# EAGLE board base (EAGLE 9.6.1), part 1 of 2
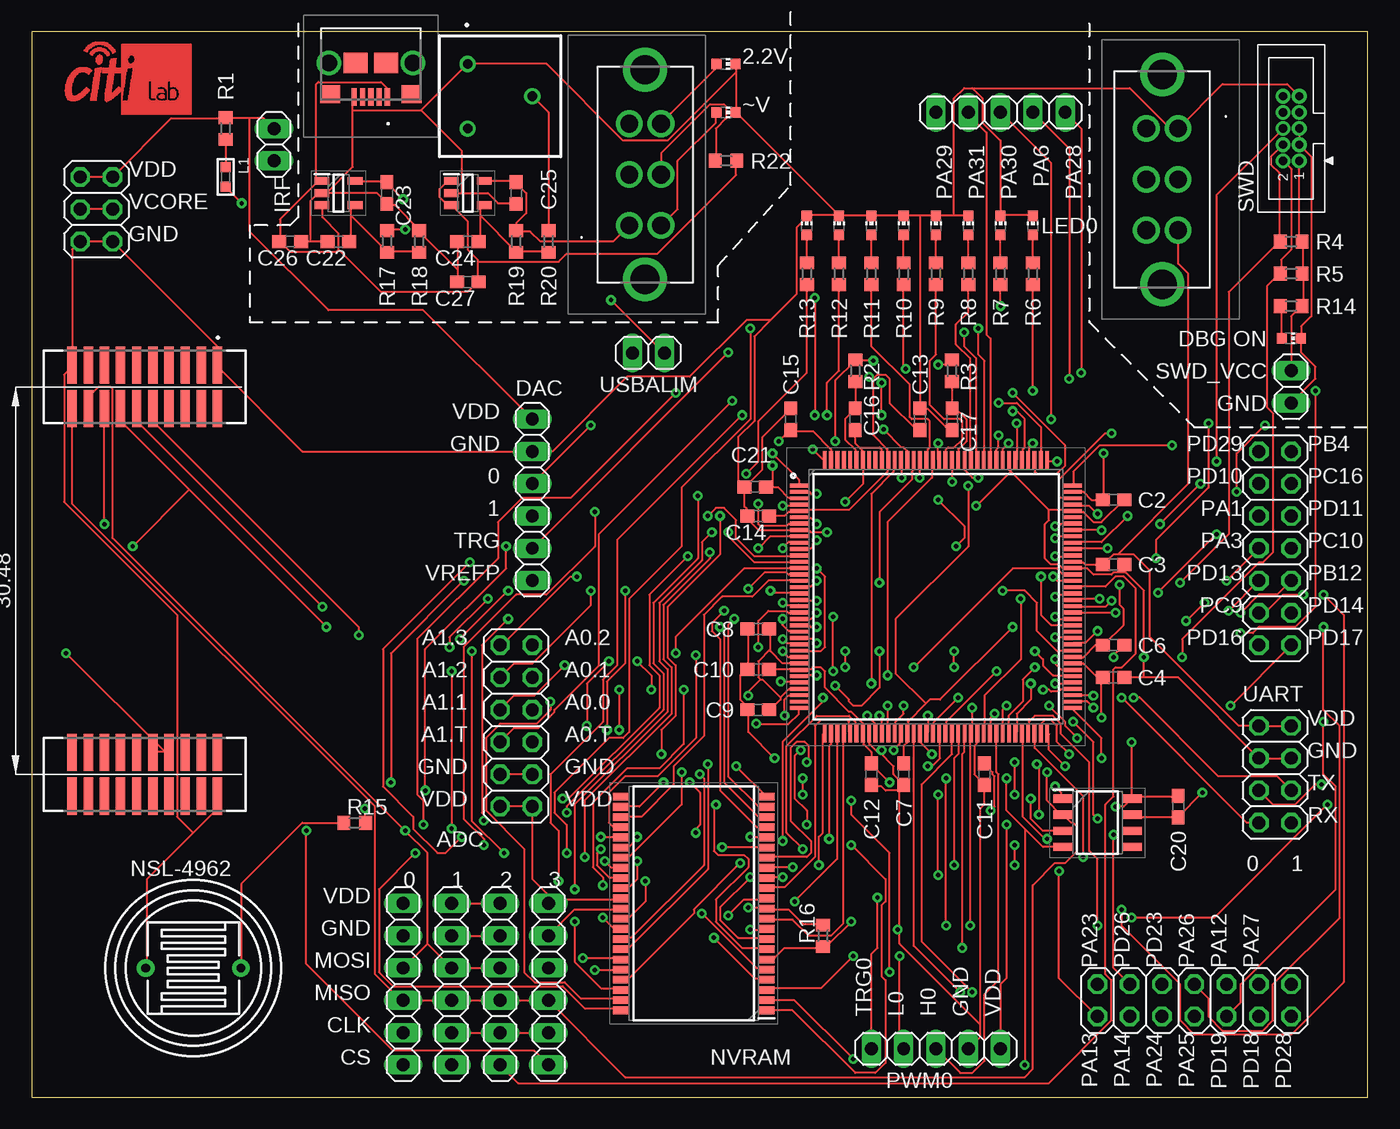
[diagram p1: board, top side]
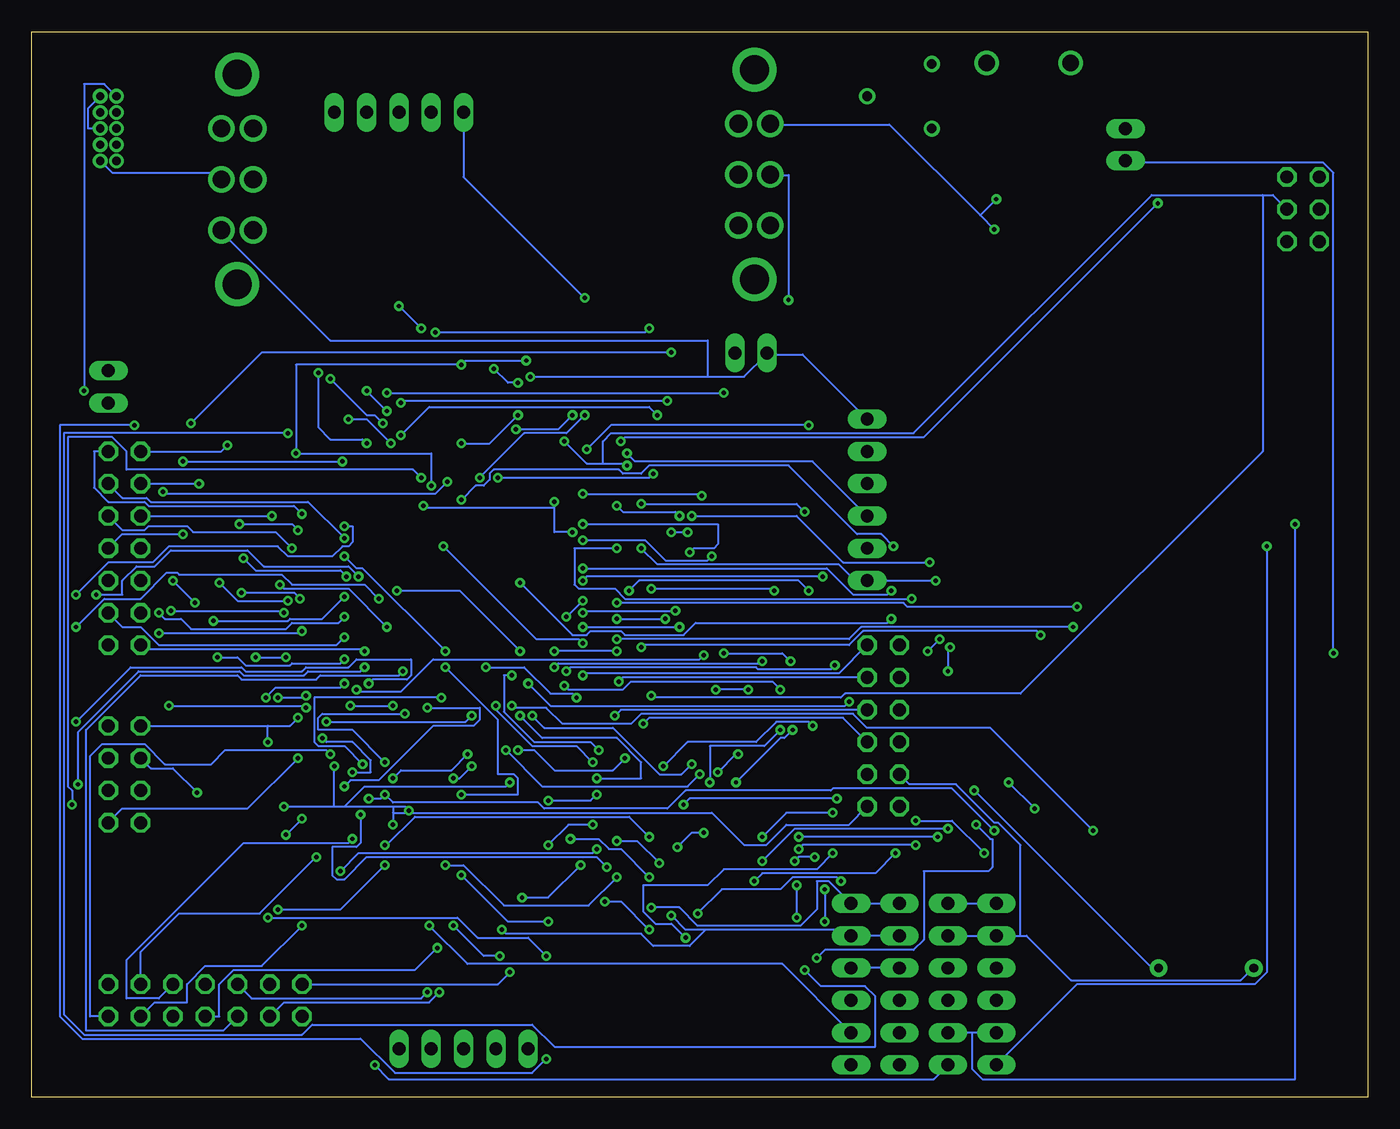
[diagram p2: board, bottom side, seen from below]

Size 105.08 x 83.81 mm. Coordinates in mm from the lower left corner, seen from the top.
Outline: 0,0 105.08,0 105.08,83.81 0,83.81 0,0
Copper layers (1*16): Top 0.035mm / dielectric 1.5mm / Bottom 0.035mm
Design rules "default": minimum track width 6mil, minimum drill 0.35mm, track to track 6mil, track to pad 6mil, pad to pad 6mil, via to via 6mil, smd to smd 6mil, copper to edge 40mil, drill to drill 6mil, minimum pad ring 10mil, minimum via ring 8mil, stop-mask expansion 4mil, vias tented up to drill 0mil, thermal gap 10mil

## Footprints (pad centres in the part's own frame; a part is rotated, then mirrored left to right if it is on the bottom)
2X06 = drill 1.016 octagon: 1 -6.35,-1.27; 2 -6.35,1.27; 3 -3.81,-1.27; 4 -3.81,1.27; 5 -1.27,-1.27; 6 -1.27,1.27; 7 1.27,-1.27; 8 1.27,1.27; 9 3.81,-1.27; 10 3.81,1.27; 11 6.35,-1.27; 12 6.35,1.27
C0603 = smd 1.1 x 1: 1 -0.85,0; 2 0.85,0
TFM-110-02-L = smd 0.74 x 2.92: 1 -5.715,-1.715; 2 -5.715,1.715; 3 -4.445,-1.715; 4 -4.445,1.715; 5 -3.175,-1.715; 6 -3.175,1.715; 7 -1.905,-1.715; 8 -1.905,1.715; 9 -0.635,-1.715; 10 -0.635,1.715; 11 0.635,-1.715; 12 0.635,1.715; 13 1.905,-1.715; 14 1.905,1.715; 15 3.175,-1.715; 16 3.175,1.715; 17 4.445,-1.715; 18 4.445,1.715; 19 5.715,-1.715; 20 5.715,1.715; 21 -5.715,28.765; 22 -5.715,32.195; 23 -4.445,28.765; 24 -4.445,32.195; 25 -3.175,28.765; 26 -3.175,32.195; 27 -1.905,28.765; 28 -1.905,32.195; 29 -0.635,28.765; 30 -0.635,32.195; 31 0.635,28.765; 32 0.635,32.195; 33 1.905,28.765; 34 1.905,32.195; 35 3.175,28.765; 36 3.175,32.195; 37 4.445,28.765; 38 4.445,32.195; 39 5.715,28.765; 40 5.715,32.195
1X06 = drill 1.016 long: 1 -6.35,0; 2 -3.81,0; 3 -1.27,0; 4 1.27,0; 5 3.81,0; 6 6.35,0
CHIP-LED0603 = smd 0.8 x 0.8: A 0,-0.75; C 0,0.75
SOT95P280X145-5N = smd 1.15 x 0.6: 1 -1.3,0.95; 2 -1.3,0; 3 -1.3,-0.95; 4 1.3,-0.95; 5 1.3,0.95
2X07 = drill 1.016 octagon: 1 -7.62,-1.27; 2 -7.62,1.27; 3 -5.08,-1.27; 4 -5.08,1.27; 5 -2.54,-1.27; 6 -2.54,1.27; 7 0,-1.27; 8 0,1.27; 9 2.54,-1.27; 10 2.54,1.27; 11 5.08,-1.27; 12 5.08,1.27; 13 7.62,-1.27; 14 7.62,1.27
1X05 = drill 1.016 long: 1 -5.08,0; 2 -2.54,0; 3 0,0; 4 2.54,0; 5 5.08,0
SOP80P1184X119-44N = smd 1.27 x 0.6: 1 -5.715,8.4; 2 -5.715,7.6; 3 -5.715,6.8; 4 -5.715,6; 5 -5.715,5.2; 6 -5.715,4.4; 7 -5.715,3.6; 8 -5.715,2.8; 9 -5.715,2; 10 -5.715,1.2; 11 -5.715,0.4; 12 -5.715,-0.4; 13 -5.715,-1.2; 14 -5.715,-2; 15 -5.715,-2.8; 16 -5.715,-3.6; 17 -5.715,-4.4; 18 -5.715,-5.2; 19 -5.715,-6; 20 -5.715,-6.8; 21 -5.715,-7.6; 22 -5.715,-8.4; 23 5.715,-8.4; 24 5.715,-7.6; 25 5.715,-6.8; 26 5.715,-6; 27 5.715,-5.2; 28 5.715,-4.4; 29 5.715,-3.6; 30 5.715,-2.8; 31 5.715,-2; 32 5.715,-1.2; 33 5.715,-0.4; 34 5.715,0.4; 35 5.715,1.2; 36 5.715,2; 37 5.715,2.8; 38 5.715,3.6; 39 5.715,4.4; 40 5.715,5.2; 41 5.715,6; 42 5.715,6.8; 43 5.715,7.6; 44 5.715,8.4
QFP50P2200X2200X160-144N = smd 1.475 x 0.3: 1 -10.738,8.75; 2 -10.738,8.25; 3 -10.738,7.75; 4 -10.738,7.25; 5 -10.738,6.75; 6 -10.738,6.25; 7 -10.738,5.75; 8 -10.738,5.25; 9 -10.738,4.75; 10 -10.738,4.25; 11 -10.738,3.75; 12 -10.738,3.25; 13 -10.738,2.75; 14 -10.738,2.25; 15 -10.738,1.75; 16 -10.738,1.25; 17 -10.738,0.75; 18 -10.738,0.25; 19 -10.738,-0.25; 20 -10.738,-0.75; 21 -10.738,-1.25; 22 -10.738,-1.75; 23 -10.738,-2.25; 24 -10.738,-2.75; 25 -10.738,-3.25; 26 -10.738,-3.75; 27 -10.738,-4.25; 28 -10.738,-4.75; 29 -10.738,-5.25; 30 -10.738,-5.75; 31 -10.738,-6.25; 32 -10.738,-6.75; 33 -10.738,-7.25; 34 -10.738,-7.75; 35 -10.738,-8.25; 36 -10.738,-8.75; 73 10.738,-8.75; 74 10.738,-8.25; 75 10.738,-7.75; 76 10.738,-7.25; 77 10.738,-6.75; 78 10.738,-6.25; 79 10.738,-5.75; 80 10.738,-5.25; 81 10.738,-4.75; 82 10.738,-4.25; 83 10.738,-3.75; 84 10.738,-3.25; 85 10.738,-2.75; 86 10.738,-2.25; 87 10.738,-1.75; 88 10.738,-1.25; 89 10.738,-0.75; 90 10.738,-0.25; 91 10.738,0.25; 92 10.738,0.75; 93 10.738,1.25; 94 10.738,1.75; 95 10.738,2.25; 96 10.738,2.75; 97 10.738,3.25; 98 10.738,3.75; 99 10.738,4.25; 100 10.738,4.75; 101 10.738,5.25; 102 10.738,5.75; 103 10.738,6.25; 104 10.738,6.75; 105 10.738,7.25; 106 10.738,7.75; 107 10.738,8.25; 108 10.738,8.75 | smd 0.3 x 1.475: 37 -8.75,-10.738; 38 -8.25,-10.738; 39 -7.75,-10.738; 40 -7.25,-10.738; 41 -6.75,-10.738; 42 -6.25,-10.738; 43 -5.75,-10.738; 44 -5.25,-10.738; 45 -4.75,-10.738; 46 -4.25,-10.738; 47 -3.75,-10.738; 48 -3.25,-10.738; 49 -2.75,-10.738; 50 -2.25,-10.738; 51 -1.75,-10.738; 52 -1.25,-10.738; 53 -0.75,-10.738; 54 -0.25,-10.738; 55 0.25,-10.738; 56 0.75,-10.738; 57 1.25,-10.738; 58 1.75,-10.738; 59 2.25,-10.738; 60 2.75,-10.738; 61 3.25,-10.738; 62 3.75,-10.738; 63 4.25,-10.738; 64 4.75,-10.738; 65 5.25,-10.738; 66 5.75,-10.738; 67 6.25,-10.738; 68 6.75,-10.738; 69 7.25,-10.738; 70 7.75,-10.738; 71 8.25,-10.738; 72 8.75,-10.738; 109 8.75,10.738; 110 8.25,10.738; 111 7.75,10.738; 112 7.25,10.738; 113 6.75,10.738; 114 6.25,10.738; 115 5.75,10.738; 116 5.25,10.738; 117 4.75,10.738; 118 4.25,10.738; 119 3.75,10.738; 120 3.25,10.738; 121 2.75,10.738; 122 2.25,10.738; 123 1.75,10.738; 124 1.25,10.738; 125 0.75,10.738; 126 0.25,10.738; 127 -0.25,10.738; 128 -0.75,10.738; 129 -1.25,10.738; 130 -1.75,10.738; 131 -2.25,10.738; 132 -2.75,10.738; 133 -3.25,10.738; 134 -3.75,10.738; 135 -4.25,10.738; 136 -4.75,10.738; 137 -5.25,10.738; 138 -5.75,10.738; 139 -6.25,10.738; 140 -6.75,10.738; 141 -7.25,10.738; 142 -7.75,10.738; 143 -8.25,10.738; 144 -8.75,10.738
SOIC127P600X175-8N = smd 1.525 x 0.65: 1 -2.712,1.905; 2 -2.712,0.635; 3 -2.712,-0.635; 4 -2.712,-1.905; 5 2.712,-1.905; 6 2.712,-0.635; 7 2.712,0.635; 8 2.712,1.905
1X02 = drill 1.016 long: 1 -1.27,0; 2 1.27,0
2X03 = drill 1.016 octagon: 1 -2.54,-1.27; 2 -2.54,1.27; 3 0,-1.27; 4 0,1.27; 5 2.54,-1.27; 6 2.54,1.27
L0603 = smd 0.8 x 0.8: 1 -0.762,0; 2 0.762,0
R0603 = smd 1 x 1.1: 1 -0.85,0; 2 0.85,0
3310Y-001 = drill 0.76 pad 1.26: 1 -2.54,-2.54; 2 0,2.54; 3 2.54,-2.54
PHB_1MM27_2X05_SNT = drill 0.65: 1 -2.54,-0.635; 2 -2.54,0.635; 3 -1.27,-0.635; 4 -1.27,0.635; 5 0,-0.635; 6 0,0.635; 7 1.27,-0.635; 8 1.27,0.635; 9 2.54,-0.635; 10 2.54,0.635
MFS201N9Z = drill 1.4 pad 2.1: 1 0,0; 2 4,0; 3 8,0; 4 0,-2.5; 5 4,-2.5; 6 8,-2.5 | drill 2.3 pad 3.45: MH1 -4.25,-1.25; MH2 12.25,-1.25
TO-8 = drill 0.7 pad 1.4: 1 -3.75,0; 2 3.75,0
2X04 = drill 1.016 octagon: 1 -3.81,-1.27; 2 -3.81,1.27; 3 -1.27,-1.27; 4 -1.27,1.27; 5 1.27,-1.27; 6 1.27,1.27; 7 3.81,-1.27; 8 3.81,1.27
101181930001LF = smd 0.4 x 1.35: 1 -1.3,2.6; 2 -0.65,2.6; 3 0,2.6; 4 0.65,2.6; 5 1.3,2.6 | drill 1.3 pad 1.95: MH1 -3.3,-0.075; MH2 3.3,-0.075 | smd 1.6 x 1.4: MP1 -3.2,2.375; MP4 3.2,2.375 | smd 1.9 x 1.6: MP2 -1.2,-0.075; MP3 1.2,-0.075

## Placement (x,y rotation side)
ADC  [2X06]  38.1,29.21 90 top
C2  100nF  [C0603]  85.09,46.99 0 top
C3  100nF  [C0603]  85.09,41.91 0 top
C4  100nF  [C0603]  85.09,33.02 0 top
C6  100nF  [C0603]  85.09,35.56 0 top
C7  100nF  [C0603]  68.58,25.4 270 top
C8  100nF  [C0603]  57.15,36.83 180 top
C9  100nF  [C0603]  57.15,30.48 180 top
C10  100nF  [C0603]  57.15,33.66 180 top
C11  100nF  [C0603]  74.93,25.4 270 top
C12  100nF  [C0603]  66.04,25.4 270 top
C13  100nF  [C0603]  69.85,53.34 270 top
C14  100nF  [C0603]  57.15,45.72 0 top
C15  4.7uF  [C0603]  59.69,53.34 270 top
C16  100nF  [C0603]  64.77,53.34 270 top
C17  100nF  [C0603]  72.39,53.34 270 top
C20  100nF  [C0603]  90.17,22.86 270 top
C21  100nF  [C0603]  56.9,48.01 0 top
C22  470pF  [C0603]  24.13,67.31 180 top
C23  2.2uF  [C0603]  27.94,71.12 270 top
C24  470pF  [C0603]  34.29,67.31 180 top
C25  2.2uF  [C0603]  38.1,71.12 270 top
C26  1uF  [C0603]  20.32,67.31 0 top
C27  1uF  [C0603]  34.29,64.14 180 top
CC2500  TFM-110-02-L-D  [TFM-110-02-L]  8.89,55.88 180 top
DAC  [1X06]  39.37,46.99 270 top
DBG_ON  KPHD-1608LVCGCK  [CHIP-LED0603]  99.06,59.69 270 top
FL1  MIC5205YM5-TR  [SOT95P280X145-5N]  24.13,71.12 0 top
FL2  MIC5205YM5-TR  [SOT95P280X145-5N]  34.29,71.12 0 top
GPIO_BOTTOM  [2X07]  91.44,7.62 0 top
GPIO_RIGHT  [2X07]  97.79,43.18 270 top
GPIO_TOP  [1X05]  76.2,77.47 0 top
IC1  FM22L16-55-TG  [SOP80P1184X119-44N]  52.07,15.24 180 top
IC2  ATSAMS70Q21A-AN  [QFP50P2200X2200X160-144N]  71.12,39.37 0 top
IC4  ADT7310TRZ  [SOIC127P600X175-8N]  83.82,21.59 0 top
JP1  [1X02]  99.06,55.88 270 top
JPPWR  [2X03]  5.08,69.85 270 top
JPRF  [1X02]  19.05,74.93 270 top
L1  10uH  [L0603]  15.24,72.39 270 top
LED0  KPHD-1608LVQBC-D  [CHIP-LED0603]  78.74,68.58 0 top
LED1  KPHD-1608LVQBC-D  [CHIP-LED0603]  76.2,68.58 0 top
LED2  KPHD-1608LVQBC-D  [CHIP-LED0603]  73.66,68.58 0 top
LED3  KPHD-1608LVQBC-D  [CHIP-LED0603]  71.12,68.58 0 top
LED4  KPHD-1608LVQBC-D  [CHIP-LED0603]  68.58,68.58 0 top
LED5  KPHD-1608LVQBC-D  [CHIP-LED0603]  66.04,68.58 0 top
LED6  KPHD-1608LVQBC-D  [CHIP-LED0603]  63.5,68.58 0 top
LED7  KPHD-1608LVQBC-D  [CHIP-LED0603]  60.96,68.58 0 top
LED_2.2  KPHD-1608LVCGCK  [CHIP-LED0603]  54.61,81.28 270 top
LED_VAR  KPHD-1608LVCGCK  [CHIP-LED0603]  54.61,77.47 270 top
PWM0  [1X05]  71.12,3.81 180 top
R1  2.2R  [R0603]  15.24,76.2 270 top
R2  470R  [R0603]  64.77,57.15 270 top
R3  470R  [R0603]  72.39,57.15 270 top
R4  100k  [R0603]  99.06,67.31 0 top
R5  100k  [R0603]  99.06,64.77 0 top
R6  330  [R0603]  78.74,64.77 270 top
R7  330  [R0603]  76.2,64.77 270 top
R8  330  [R0603]  73.66,64.77 270 top
R9  330  [R0603]  71.12,64.77 270 top
R10  330  [R0603]  68.58,64.77 270 top
R11  330  [R0603]  66.04,64.77 270 top
R12  330  [R0603]  63.5,64.77 270 top
R13  330  [R0603]  60.96,64.77 270 top
R14  698  [R0603]  99.06,62.23 0 top
R15  6k  [R0603]  25.4,21.59 0 top
R16  [R0603]  62.23,12.7 90 top
R17  100k  [R0603]  27.94,67.31 270 top
R18  76.8k  [R0603]  30.48,67.31 90 top
R19  191k  [R0603]  38.1,67.31 270 top
R20  115k  [R0603]  40.64,67.31 90 top
R21  3310Y-001-104L  [3310Y-001]  36.83,78.74 270 top
R22  1.58k  [R0603]  54.61,73.66 0 top
SPI0_0  [1X06]  29.21,8.89 270 top
SPI0_1  [1X06]  33.02,8.89 270 top
SPI0_2  [1X06]  36.83,8.89 270 top
SPI0_3  [1X06]  40.64,8.89 270 top
SWD  PHB_1MM27_2X05_SNT  [PHB_1MM27_2X05_SNT]  99.06,76.2 90 top
SWITCH_ALIM  MFS201N-9-Z  [MFS201N9Z]  46.99,68.58 90 top
SWITCH_SWD  MFS201N-9-Z  [MFS201N9Z]  90.17,76.2 270 top
U$1  NSL-4962  [TO-8]  12.7,10.16 180 top
U$2  [CITI_LAB_LOGO_FRONT_SMALL]  7.62,80.01 0 top
UART  [2X04]  97.79,25.4 270 top
USB-ALIM  10118193-0001LF  [101181930001LF]  26.67,81.28 180 top
USBALIM  [1X02]  48.51,58.55 180 top